# EAGLE design sensor (EAGLE 9.6.2)
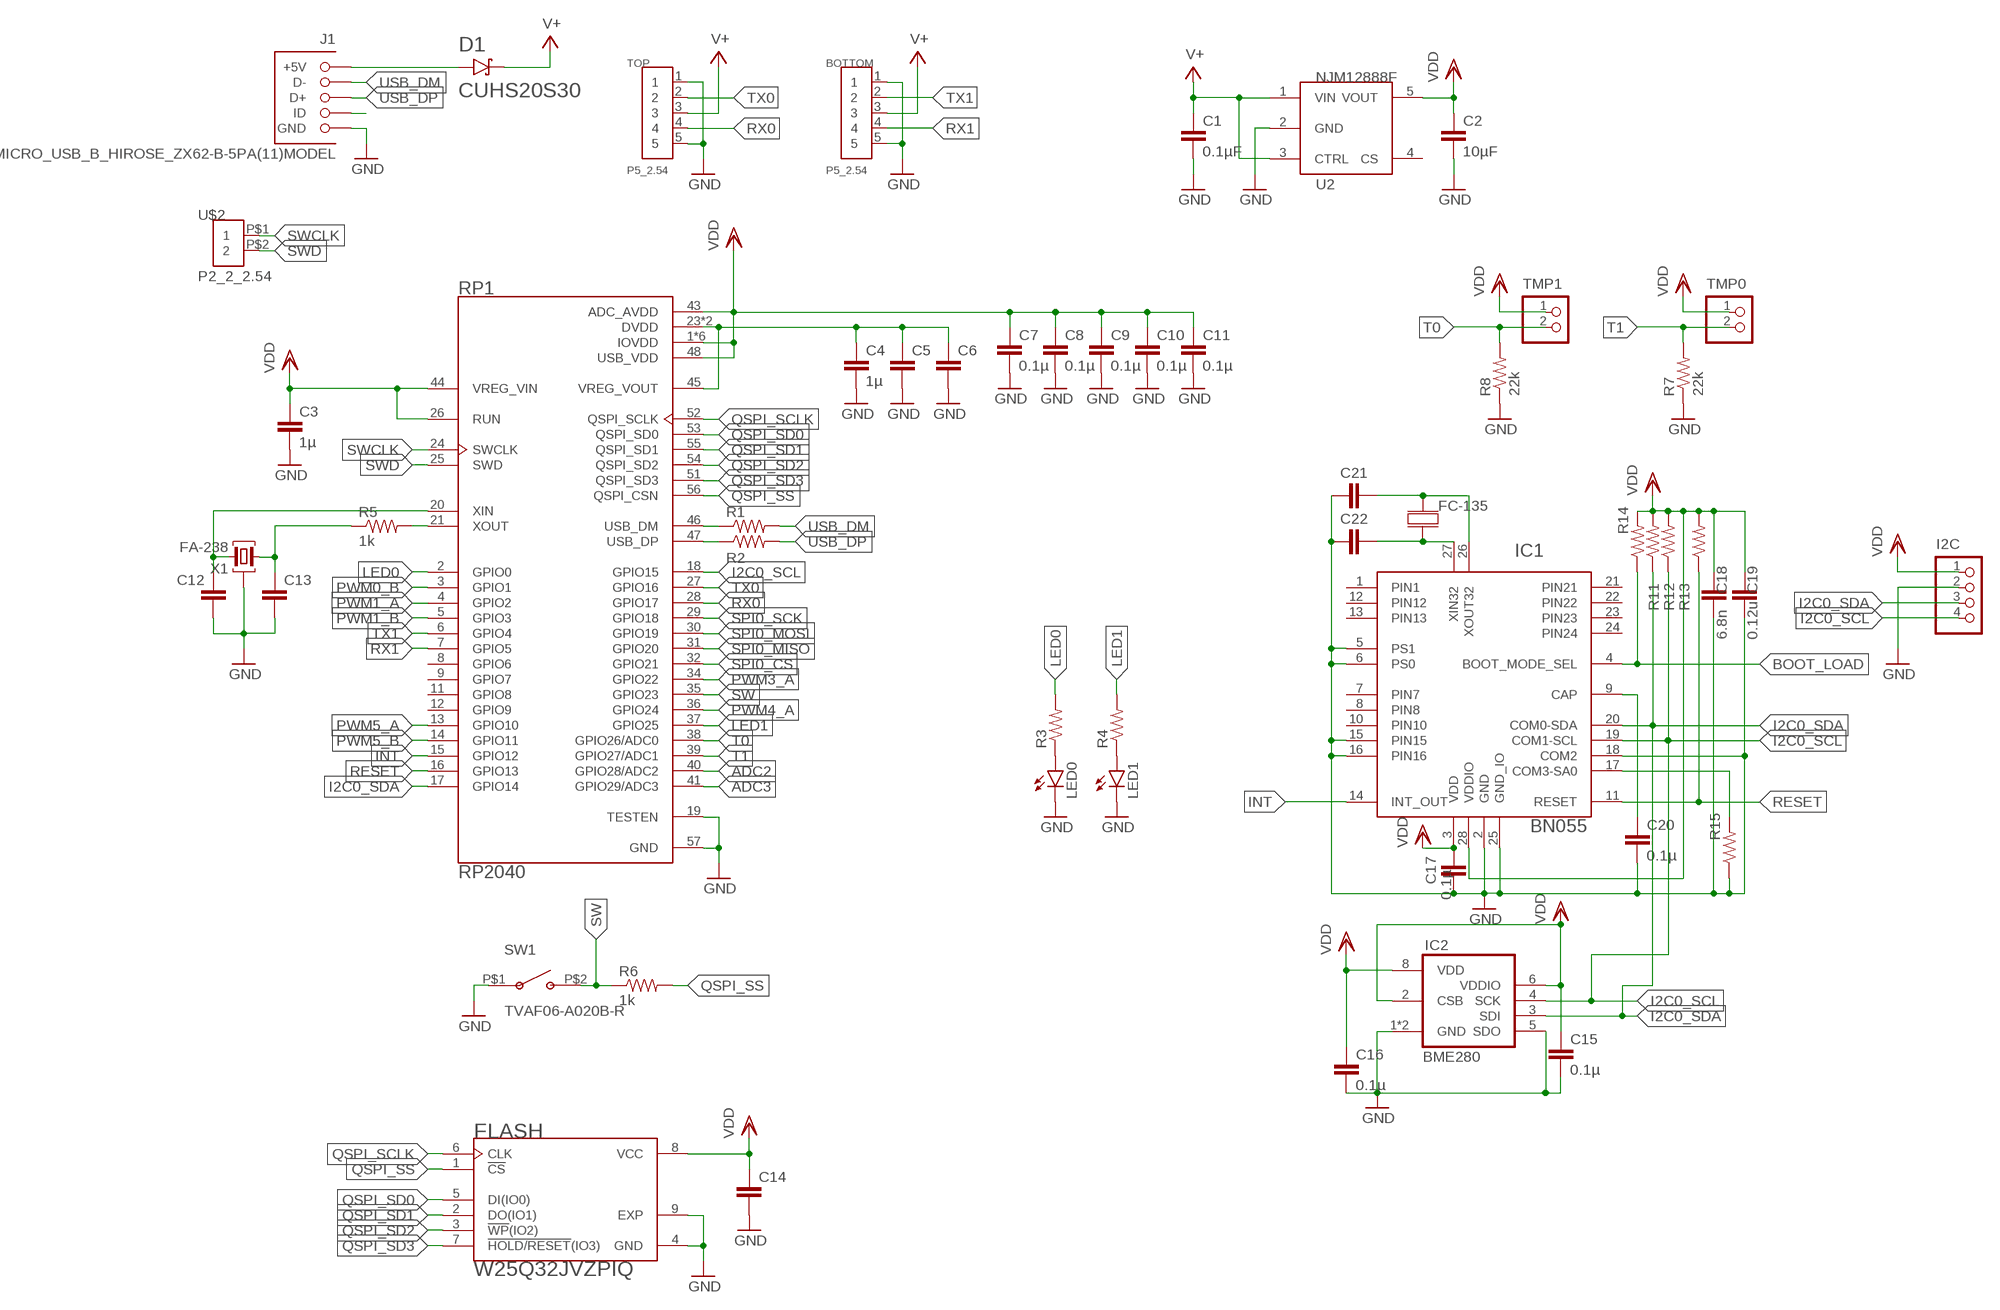
[diagram p0: schematic, sheet 1]

## Parts
BOTTOM  P5_2.54  [P5_2.54]
C1  0.1µF  C-EUC0402  [C0402]
C2  10µF  C-EUC0402  [C0402]
C3  1µ  C-EUC0402  [C0402]
C4  1µ  C-EUC0402  [C0402]
C5  C-EUC0402  [C0402]
C6  C-EUC0402  [C0402]
C7  0.1µ  C-EUC0402  [C0402]
C8  0.1µ  C-EUC0402  [C0402]
C9  0.1µ  C-EUC0402  [C0402]
C10  0.1µ  C-EUC0402  [C0402]
C11  0.1µ  C-EUC0402  [C0402]
C12  C-EUC0402  [C0402]
C13  C-EUC0402  [C0402]
C14  C-EUC0402  [C0402]
C15  0.1µ  C-EUC0402  [C0402]
C16  0.1µ  C-EUC0402  [C0402]
C17  0.1µ  C-EUC0402  [C0402]
C18  6.8n  C-EUC0402  [C0402]
C19  0.12u  C-EUC0402  [C0402]
C20  0.1µ  C-EUC0402  [C0402]
C21  C-EUC0402  [C0402]
C22  C-EUC0402  [C0402]
D1  CUHS20S30  [CUHS20S30]
FC-135  FC-135  [FC-135]
FLASH  W25Q32JVZPIQ  [SON127P600X500X80-9N]
I2C  B4B-PH-K-S  [B4B-PH-K-S]
IC1  BN055  1658_BNO055  [LGA-28_3.80X5.20/0.5]
IC2  BME280  [BME280]
J1  MICRO_USB_B_HIROSE_ZX62-B-5PA(11)MODEL  [GHI-CONNECTORS_10118192-0001LF(MICRO-USB-B-AMPHENOL-FCI)]
LED0  LEDCHIPLED_0603  [CHIPLED_0603]
LED1  LEDCHIPLED_0603  [CHIPLED_0603]
R1  R-US_R0402  [R0402]
R2  R-US_R0402  [R0402]
R3  R-US_R0402  [R0402]
R4  R-US_R0402  [R0402]
R5  1k  R-US_R0402  [R0402]
R6  1k  R-US_R0402  [R0402]
R7  22k  R-US_R0402  [R0402]
R8  22k  R-US_R0402  [R0402]
R11  R-US_R0402  [R0402]
R12  R-US_R0402  [R0402]
R13  R-US_R0402  [R0402]
R14  R-US_R0402  [R0402]
R15  R-US_R0402  [R0402]
RP1  RP2040  [QFN40P700X700X90-57N]
SW1  TVAF06-A020B-R  [TVAF06-A020B-R]
TMP0  S2B-PH-K-S  [S2B-PH-K-S]
TMP1  S2B-PH-K-S  [S2B-PH-K-S]
TOP  P5_2.54  [P5_2.54]
U2  NJM12888F  [SOT95P240X110-5N]
U$2  P2_2_2.54  [P2_2.54]
X1  FA-238  [FA-238]

## Nets
1V2: C4.1 C5.1 C6.1 RP1.23(DVDD) RP1.45(VREG_VOUT) RP1.50(DVDD)
ADC2: RP1.40(GPIO28/ADC2)
ADC3: RP1.41(GPIO29/ADC3)
BOOT_LOAD: IC1.4(BOOT_MODE_SEL) R14.1
GND: BOTTOM.1 BOTTOM.5 C1.2 C2.2 C3.2 C4.2 C5.2 C6.2 C7.2 C8.2 C9.2 C10.2 C11.2 C12.2 C13.2 C14.2 C15.2 C16.2 C17.2 C18.2 C19.2 C20.2 C21.1 C22.1 FLASH.4(GND) FLASH.9(EXP) I2C.2 IC1.2(GND) IC1.5(PS1) IC1.6(PS0) IC1.15(PIN15) IC1.16(PIN16) IC1.18(COM2) IC1.25(GND_IO) IC2.1(GND) IC2.5(SDO) IC2.7(GND) J1.CGND1(GND) J1.CGND2(GND) J1.CGND3(GND) J1.CGND4(GND) J1.CGND5(GND) J1.CGND6(GND) J1.GND LED0.C LED1.C R7.1 R8.1 R15.1 RP1.19(TESTEN) RP1.57(GND) SW1.P$1(A) TOP.1 TOP.5 U2.2(GND) X1.2(G) X1.4(G)
I2C0_SCL: I2C.4 IC1.19(COM1-SCL) IC2.4(SCK) R12.1 RP1.18(GPIO15)
I2C0_SDA: I2C.3 IC1.20(COM0-SDA) IC2.3(SDI) R11.1 RP1.17(GPIO14)
INT: IC1.14(INT_OUT) RP1.15(GPIO12)
LED0: R3.2 RP1.2(GPIO0)
LED1: R4.2 RP1.37(GPIO25)
N$1: C20.1 IC1.9(CAP)
N$3: C22.2 FC-135.P$2 IC1.27(XIN32)
N$4: C21.2 FC-135.P$1 IC1.26(XOUT32)
N$5: J1.ID
N$6: D1.A J1.VBUS(+5V)
N$8: LED0.A R3.1
N$9: LED1.A R4.1
N$10: IC1.17(COM3-SA0) R15.2
N$11: C13.1 R5.1 X1.1
PWM0_B: RP1.3(GPIO1)
PWM1_A: RP1.4(GPIO2)
PWM1_B: RP1.5(GPIO3)
PWM3_A: RP1.34(GPIO22)
PWM4_A: RP1.36(GPIO24)
PWM5_A: RP1.13(GPIO10)
PWM5_B: RP1.14(GPIO11)
QSPI_SCLK: FLASH.6(CLK) RP1.52(QSPI_SCLK)
QSPI_SD0: FLASH.5(DI(IO0)) RP1.53(QSPI_SD0)
QSPI_SD1: FLASH.2(DO(IO1)) RP1.55(QSPI_SD1)
QSPI_SD2: FLASH.3(!WP!(IO2)) RP1.54(QSPI_SD2)
QSPI_SD3: FLASH.7(!HOLD/RESET!(IO3)) RP1.51(QSPI_SD3)
QSPI_SS: FLASH.1(!CS) R6.2 RP1.56(QSPI_CSN)
RESET: IC1.11(RESET) R13.1 RP1.16(GPIO13)
RX0: RP1.28(GPIO17) TOP.4
RX1: BOTTOM.4 RP1.7(GPIO5)
SPI0_CS: RP1.32(GPIO21)
SPI0_MISO: RP1.31(GPIO20)
SPI0_MOSI: RP1.30(GPIO19)
SPI0_SCK: RP1.29(GPIO18)
SW: R6.1 RP1.35(GPIO23) SW1.P$2(B)
SWCLK: RP1.24(SWCLK) U$2.P$1
SWD: RP1.25(SWD) U$2.P$2
T0: R8.2 RP1.38(GPIO26/ADC0) TMP1.2
T1: R7.2 RP1.39(GPIO27/ADC1) TMP0.2
TX0: RP1.27(GPIO16) TOP.2
TX1: BOTTOM.2 RP1.6(GPIO4)
USB_DM: J1.D- R1.2
USB_DM_1: R1.1 RP1.46(USB_DM)
USB_DP: J1.D+ R2.2
USB_DP_1: R2.1 RP1.47(USB_DP)
V+: BOTTOM.3 C1.1 D1.C TOP.3 U2.1(VIN) U2.3(CTRL)
VDD: C2.1 C3.1 C7.1 C8.1 C9.1 C10.1 C11.1 C14.1 C15.1 C16.1 C17.1 C18.1 C19.1 FLASH.8(VCC) I2C.1 IC1.3(VDD) IC1.28(VDDIO) IC2.2(CSB) IC2.6(VDDIO) IC2.8(VDD) R11.2 R12.2 R13.2 R14.2 RP1.1(IOVDD) RP1.10(IOVDD) RP1.22(IOVDD) RP1.26(RUN) RP1.33(IOVDD) RP1.42(IOVDD) RP1.43(ADC_AVDD) RP1.44(VREG_VIN) RP1.48(USB_VDD) RP1.49(IOVDD) TMP0.1 TMP1.1 U2.5(VOUT)
XIN1: C12.1 RP1.20(XIN) X1.3
XOUT1: R5.2 RP1.21(XOUT)
Unconnected: IC1.1(PIN1) IC1.7(PIN7) IC1.8(PIN8) IC1.10(PIN10) IC1.12(PIN12) IC1.13(PIN13) IC1.21(PIN21) IC1.22(PIN22) IC1.23(PIN23) IC1.24(PIN24) RP1.8(GPIO6) RP1.9(GPIO7) RP1.11(GPIO8) RP1.12(GPIO9) U2.4(CS)

## Library data of the parts
BOTTOM TOP = pins:P5_2.54
C1-C22 = rcl:C-EU: CAPACITOR, European symbol; SPICEPREFIX: C
D1 = diodes:CUHS20S30
FC-135 = tere:FC-135
FLASH = W25Q32JVZPIQ:W25Q32JVZPIQ: Serial Flash Memory With Dual, Quad Spi Check availability <https://pricing.snapeda.com/parts/W25Q32JVZPIQ/Winbond/view-part?ref=eda>; AVAILABILITY: In Stock; DESCRIPTION: FLASH - NOR Memory IC 32Mb (4M x 8) SPI - Quad I/O 133 MHz 8-WSON (6x5); MF: Winbond; MP: W25Q32JVZPIQ; PACKAGE: WSON-8 Winbond; PRICE: None; PURCHASE-URL: https://pricing.snapeda.com/search/part/W25Q32JVZPIQ/?ref=eda
I2C = jst-ph:B4B-PH-*: Wire-to-Board 2.0mm pitch top mount connector Source: http://www.jst-mfg.com/product/pdf/jpn/PH.pdf http://www.jst-mfg.com/product/detail.php?series=199
IC1 = BNO055:1658_BNO055: BN055 Intelligent 9-axis absolute orientation sensor; PART_NUMBER: BNO055
IC2 = bosch-bme280:BME280: DIGITAL HUMIDITY, PRESSURE AND TEMPERATURE SENSOR * Digital interface I²C (up to 3.4 MHz) and SPI (3 and 4 wire, up to 10 MHz)* Supply voltage VDD main supply voltage range: 1.71 V to 3.6 V*VDDIO interface voltage range: 1.2 V to 3.6 V Operating range -40…+85 °C, 0…100 % rel. humidity, 300…1100 hPa The library has been designed by Richard Magdycz <https://www.facebook.com/groups/eaglecadsoftUK>
J1 = connector:MICRO_USB_B_HIROSE_ZX62-B-5PA(11): Connector Receptacle USB - micro B 2.0 5 Position Surface Mount, Right Angle, Horizontal Bottom Mount
LED0 LED1 = led:LED: LED OSRAM: - CHIPLED LG R971, LG N971, LY N971, LG Q971, LY Q971, LO R971, LY R971 LH N974, LH R974 LS Q976, LO Q976, LY Q976 LO Q996 - Hyper CHIPLED LW Q18S LB Q993, LB Q99A, LB R99A - SideLED LS A670, LO A670, LY A670, LG A670, LP A670 LB A673, LV A673, LT A673, LW A673 LH A674 LY A675 LS A676, LA A676, LO A676, LY A676, LW A676 LS A679, LY A679, LG A679 - Hyper Micro SIDELED® LS Y876, LA Y876, LO Y876, LY Y876 LT Y87S - SmartLED LW L88C, LW L88S LB L89C, LB L89S, LG L890 LS L89K, LO L89K, LY L89K LS L896, LA L896, LO L896, LY L896 - TOPLED LS T670, LO T670, LY T670, LG T670, LP T670 LSG T670, LSP T670, LSY T670, LOP T670, LYG T670 LG T671, LOG T671, LSG T671 LB T673, LV T673, LT T673, LW T673 LH T674 LS T676, LA T676, LO T676, LY T676, LB T676, LH T676, LSB T676, LW T676 LB T67C, LV T67C, LT T67C, LS T67K, LO T67K, LY T67K, LW E67C LS E67B, LA E67B, LO E67B, LY E67B, LB E67C, LV E67C, LT E67C LW T67C LS T679, LY T679, LG T679 LS T770, LO T770, LY T770, LG T770, LP T770 LB T773, LV T773, LT T773, LW T773 LH T774 LS E675, LA E675, LY E675, LS T675 LS T776, LA T776, LO T776, LY T776, LB T776 LHGB T686 LT T68C, LB T68C - Hyper Mini TOPLED® LB M676 - Mini TOPLED Santana® LG M470 LS M47K, LO M47K, LY M47K Source: http://www.osram.convergy.de LUXEON: - LUMILED® LXK2-PW12-R00, LXK2-PW12-S00, LXK2-PW14-U00, LXK2-PW14-V00 LXK2-PM12-R00, LXK2-PM12-S00, LXK2-PM14-U00 LXK2-PE12-Q00, LXK2-PE12-R00, LXK2-PE12-S00, LXK2-PE14-T00, LXK2-PE14-U00 LXK2-PB12-K00, LXK2-PB12-L00, LXK2-PB12-M00, LXK2-PB14-N00, LXK2-PB14-P00, LXK2-PB14-Q00 LXK2-PR12-L00, LXK2-PR12-M00, LXK2-PR14-Q00, LXK2-PR14-R00 LXK2-PD12-Q00, LXK2-PD12-R00, LXK2-PD12-S00 LXK2-PH12-R00, LXK2-PH12-S00 LXK2-PL12-P00, LXK2-PL12-Q00, LXK2-PL12-R00 Source: www.luxeon.com KINGBRIGHT: KA-3528ASYC Source: www.kingbright.com
R1-R8 R11-R15 = rcl:R-US_: RESISTOR, American symbol; SPICEPREFIX: R
RP1 = RP2040:RP2040: Check availability <https://pricing.snapeda.com/parts/RP2040/Raspberry%20Pi/view-part?ref=eda>; AVAILABILITY: In Stock; DESCRIPTION: RP2040 chip for Raspberry Pi Pico - ARM® Cortex®-M0+ MCU 32-Bit; MF: Raspberry Pi; MP: RP2040; PACKAGE: None; PRICE: None; PURCHASE-URL: https://pricing.snapeda.com/search/part/RP2040/?ref=eda
SW1 = switches:TVAF06-A020B-R
TMP0 TMP1 = jst-ph:S2B-PH-*: Wire-to-Board 2.0mm pitch side mount connector Source: http://www.jst-mfg.com/product/pdf/jpn/PH.pdf http://www.jst-mfg.com/product/detail.php?series=199
U2 = regulators:NJM12888F
U$2 = pins:P2_2_2.54
X1 = crystal':FA-238: CRYSTAL

## Board
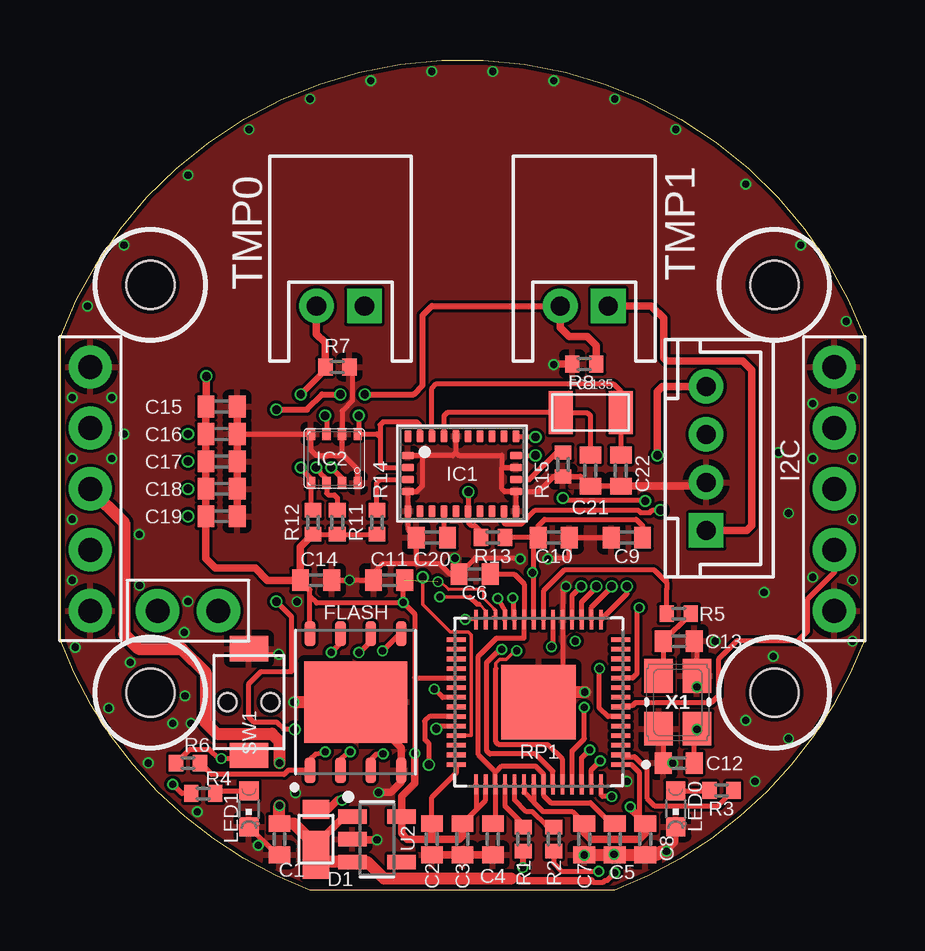
[diagram p1: board, top side]
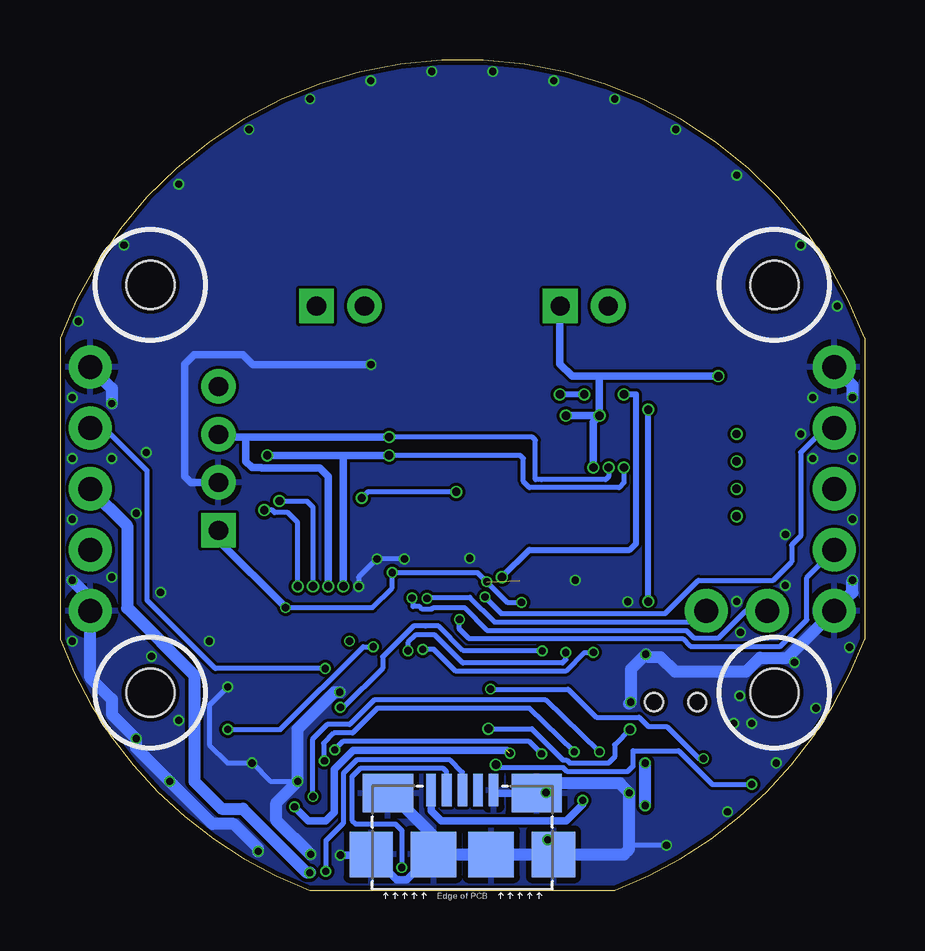
[diagram p2: board, bottom side, seen from below]

Size 33.53 x 34.61 mm. Coordinates in mm from the lower left corner, seen from the top.
Outline: 33.53,23.01 33.53,10.46 arc-49 23.11,0 10.41,0 arc-49 0,10.46 0,23.01 arc-139 33.53,23.01
Copper layers (1*16): Top 0.035mm / dielectric 1mm / Bottom 0.035mm
Design rules "jlcpcb-2layers-1.0mm": minimum track width 5mil, minimum drill 0.3mm, track to track 5mil, track to pad 5mil, pad to pad 5mil, via to via 5mil, smd to smd 5mil, copper to edge 0.2mm, drill to drill 6mil, minimum pad ring 10mil, minimum via ring 3mil, stop-mask expansion 4mil, vias tented up to drill 1mm, thermal gap 10mil
Holes 2 mm at 29.76,25.24 29.76,8.24 3.76,25.24 3.76,8.24

### Footprints (pad centres in the part's own frame; a part is rotated, then mirrored left to right if it is on the bottom)
P5_2.54 = drill 1: 1 0,5.08; 2 0,2.54; 3 0,0; 4 0,-2.54; 5 0,-5.08
C0402 = smd 0.7 x 0.9: 1 -0.65,0; 2 0.65,0
CUHS20S30 = smd 0.8 x 1.1: A 1.25,0 | smd 2 x 1.1: C -0.65,0
FC-135 = smd 1 x 1.8: P$1 0,0; P$2 2.5,0
SON127P600X500X80-9N = smd 1.04 x 0.44: 1 -2.845,1.905; 2 -2.845,0.635; 3 -2.845,-0.635; 4 -2.845,-1.905; 5 2.845,-1.905; 6 2.845,-0.635; 7 2.845,0.635; 8 2.845,1.905 | smd 3.4 x 4.3: 9 0,0
B4B-PH-K-S = drill 0.8 square: 1 -3,0 | drill 0.8: 2 -1,0; 3 1,0; 4 3,0
LGA-28_3.80X5.20/0.5 = smd 0.3 x 0.5: 1 -2.25,1.56; 6 -2.25,-1.56; 7 -1.75,-1.56; 8 -1.25,-1.56; 9 -0.75,-1.56; 10 -0.25,-1.56; 11 0.25,-1.56; 12 0.75,-1.56; 13 1.25,-1.56; 14 1.75,-1.56; 15 2.25,-1.56; 20 2.25,1.56; 21 1.75,1.56; 22 1.25,1.56; 23 0.75,1.56; 24 0.25,1.56; 25 -0.25,1.56; 26 -0.75,1.56; 27 -1.25,1.56; 28 -1.75,1.56 | smd 0.5 x 0.3: 2 -2.25,0.75; 3 -2.25,0.25; 4 -2.25,-0.25; 5 -2.25,-0.75; 16 2.25,-0.75; 17 2.25,-0.25; 18 2.25,0.25; 19 2.25,0.75
BME280 = smd 0.35 x 0.5: 1 0.975,-1.025; 2 0.325,-1.025; 3 -0.325,-1.025; 4 -0.975,-1.025; 5 -0.975,1.025; 6 -0.325,1.025; 7 0.325,1.025; 8 0.975,1.025
GHI-CONNECTORS_10118192-0001LF(MICRO-USB-B-AMPHENOL-FCI) = smd 1.8 x 1.9: CGND1 -3.8,0; CGND4 3.8,0 | smd 1.9 x 1.9: CGND2 -1.2,0; CGND3 1.2,0 | smd 2.1 x 1.6: CGND5 3.1,2.55; CGND6 -3.1,2.55 | smd 0.4 x 1.35: D+ 0,2.675; D- -0.65,2.675; GND 1.3,2.675; ID 0.65,2.675; VBUS -1.3,2.675
CHIPLED_0603 = smd 0.8 x 0.8: A 0,-0.75; C 0,0.75
R0402 = smd 0.6 x 0.7: 1 -0.5,0; 2 0.5,0
QFN40P700X700X90-57N = smd 0.84 x 0.2: 1 -3.435,2.6; 2 -3.435,2.2; 3 -3.435,1.8; 4 -3.435,1.4; 5 -3.435,1; 6 -3.435,0.6; 7 -3.435,0.2; 8 -3.435,-0.2; 9 -3.435,-0.6; 10 -3.435,-1; 11 -3.435,-1.4; 12 -3.435,-1.8; 13 -3.435,-2.2; 14 -3.435,-2.6; 29 3.435,-2.6; 30 3.435,-2.2; 31 3.435,-1.8; 32 3.435,-1.4; 33 3.435,-1; 34 3.435,-0.6; 35 3.435,-0.2; 36 3.435,0.2; 37 3.435,0.6; 38 3.435,1; 39 3.435,1.4; 40 3.435,1.8; 41 3.435,2.2; 42 3.435,2.6 | smd 0.2 x 0.84: 15 -2.6,-3.435; 16 -2.2,-3.435; 17 -1.8,-3.435; 18 -1.4,-3.435; 19 -1,-3.435; 20 -0.6,-3.435; 21 -0.2,-3.435; 22 0.2,-3.435; 23 0.6,-3.435; 24 1,-3.435; 25 1.4,-3.435; 26 1.8,-3.435; 27 2.2,-3.435; 28 2.6,-3.435; 43 2.6,3.435; 44 2.2,3.435; 45 1.8,3.435; 46 1.4,3.435; 47 1,3.435; 48 0.6,3.435; 49 0.2,3.435; 50 -0.2,3.435; 51 -0.6,3.435; 52 -1,3.435; 53 -1.4,3.435; 54 -1.8,3.435; 55 -2.2,3.435; 56 -2.6,3.435 | smd 3.1 x 3.1: 57 0,0
TVAF06-A020B-R = smd 1.6 x 1.05: P$1 0,2.225; P$2 0,-2.225 | hole 0.75: -0.9,0; 0.9,0
S2B-PH-K-S = drill 0.8 square: 1 1,0 | drill 0.8: 2 -1,0
SOT95P240X110-5N = smd 1.18 x 0.609: 1 -1.024,0.95; 2 -1.024,0; 3 -1.024,-0.95; 4 1.024,-0.95; 5 1.024,0.95
P2_2.54 = drill 1: P$1 0,1.27; P$2 0,-1.27
FA-238 = smd 1.4 x 1.2: 1 -1.1,-0.8; 2 1.1,-0.8; 3 1.1,0.8; 4 -1.1,0.8

### Placement (x,y rotation side)
BOTTOM  32.26,16.74 0 top
C1  9.14,2.13 270 top
C2  15.49,2.13 270 top
C3  16.76,2.13 270 top
C4  18.03,2.13 270 top
C5  23.11,2.13 270 top
C6  17.27,13.18 180 top
C7  21.84,2.13 270 top
C8  24.38,2.13 270 top
C9  23.62,14.7 180 top
C10  20.57,14.7 0 top
C11  13.72,12.93 180 top
C12  25.78,5.31 180 top
C13  25.78,10.39 0 top
C14  10.67,12.93 0 top
C15  6.73,20.16 0 top
C16  6.73,19.02 0 top
C17  6.73,17.88 0 top
C18  6.73,16.74 0 top
C19  6.73,15.59 0 top
C20  15.49,14.7 180 top
C21  22.1,17.5 90 top
C22  23.37,17.5 90 top
D1  10.67,2.13 90 top
FC-135  20.86,19.92 0 top
FLASH  12.32,7.85 90 top
I2C  26.92,18.01 90 top
IC1  16.75,17.37 0 top
IC2  11.43,18.01 0 top
J1  16.76,1.5 0 bottom
LED0  25.65,3.4 180 top
LED1  7.87,3.4 180 top
R1  19.3,2.13 270 top
R2  20.57,2.13 270 top
R3  27.56,4.16 0 top
R4  5.97,4.04 180 top
R5  25.78,11.53 180 top
R6  5.33,5.31 0 top
R7  11.56,21.82 180 top
R8  21.84,21.94 0 top
R11  11.56,15.34 270 top
R12  10.54,15.34 270 top
R13  18.03,14.7 0 top
R14  13.21,15.34 270 top
R15  20.95,17.75 90 top
RP1  19.94,7.85 180 top
SW1  7.87,7.85 0 top
TMP0  11.68,24.36 0 top
TMP1  21.84,24.36 0 top
TOP  1.26,16.74 0 top
U2  13.21,2.13 0 top
U$2  5.33,11.66 90 top
X1  25.74,7.84 270 top

### Tracks (layer width: path | path; a pad name or v marks a point on that pad's centre or on a via)
1V2
  Top 0.2: C4.1 18.14,2.89 RP1.45 18.14,4.9 18.16,4.92 | C5.1 22.97,2.78 22.1,3.65 20.45,3.65 20.14,3.96 RP1.50 20.14,4.85 19.81,5.18 18.41,5.18 18.16,4.92 | 18.16,4.92 17.43,5.65 17.43,9.75 18.2,10.52 19.34,10.52 RP1.23 19.34,12.76 18.92,13.18 C6.1
BOOT_LOAD
  Top 0.2: R14.1 13.21,16.99 13.34,17.12 IC1.4
GND  (via drill 0.3)
  Top 0.2: 21.19,14.67 C10.2 | C10.2 21.22,13.86 20.36,13.86 v20.32,13.81 | C14.2 v12.06,12.93 C11.2 13.07,13.25 13.41,13.6 14.86,13.6 | 14.86,13.6 15.83,13.6 16.25,13.18 C6.2 17.3,13.86 19.13,13.86 v19.18,13.81 | C10.2 C9.2 | RP1.57 20.94,8.85 RP1.19 20.94,12.53 v21.08,12.67 | SW1.P$1 8.1,9.84 v9.12,9.84 | LED1.C 8.45,2.07 | 8.45,2.07 9.04,1.48 C1.2 | LED0.C 25.65,2 v25.27,1.62 | X1.2 25.13,6.55 C12.2 v25.53,5.31 | C13.2 26.54,10.28 X1.4 v26.54,8.48 | C16.2 IC2.5 10.45,18.35 10.67,18.13 11.7,18.13 11.75,18.19 | R7.1 12.18,21.69 12.18,20.41 11.75,19.98 IC2.7 11.75,18.19 | IC2.1 12.4,17.54 11.75,18.19 | IC1.25 16.5,18.25 | 15.11,18.12 16.37,18.12 16.5,18.25 | 15.11,18.12 IC1.2 | 18.41,17.62 IC1.18 | IC1.16 IC1.15 | C22.1 C21.1 21.69,17.25 R15.1 20.57,17.25 19.94,16.62 IC1.16 | 14.86,13.6 14.84,13.62 C20.2 14.5,15.05 IC1.6 IC1.5 14.86,16.62 15.11,16.87 15.11,18.12 | IC1.16 18.53,16.62 18.41,16.74 18.41,17.62 | 16.5,18.25 16.61,18.13 18.41,18.13 18.41,17.62 | v8.25,1.88 8.45,2.07
  Top 0.305: FLASH.9 14.22,5.94 FLASH.4 14.22,4.51 13.79,4.07 v13.27,4.07 | v13.21,2.1 12.21,2.1 U2.2 | C7.2 v21.84,1.46 | C4.2 C3.2 C2.2 | C15.2 C16.2 C17.2 C18.2 C19.2 | C22.1 26.77,16.85 I2C.2 | v20.57,21.92 20.59,21.94 R8.1
  Top 0.508: v9.74,7.85 FLASH.9 | C7.2 C5.2 C8.2 24.89,1.48 25.04,1.62 v25.27,1.62 | RP1.57 20.35,8.26 v21.87,8.26
  Bottom 0.2: J1.CGND2 17.65,1.5 | v23.62,4.54 24.77,4.54 v25.53,5.31 26.54,5.31 27.3,6.07 27.3,7.72 v26.54,8.48 | v19.18,13.81 v20.32,13.81 21.08,13.05 v21.08,12.67 | v8.25,1.88 9.68,1.88 9.81,2
  Bottom 0.305: J1.CGND4 13.21,1.74 v13.21,2.1 | J1.GND 15.34,4.05 J1.CGND5 | v21.84,1.46 20.59,1.46 J1.CGND1 20.55,1.5 19.5,0.44 19.08,0.44 18.02,1.5 | v20.57,21.92 25.51,21.92 25.91,22.32 27.94,22.32 28.32,21.94 28.32,17.24 28.08,17.01 I2C.2
  Bottom 0.508: J1.CGND6 19.75,4.05 17.96,2.26 J1.CGND2 18.02,1.5 | 17.65,1.5 J1.CGND3 J1.CGND4 10.03,1.5 9.81,1.72 9.81,2 v9.81,4.07 10.2,4.46 13.25,4.46 J1.CGND5 | 9.81,7.78 v9.74,7.85 9.74,9.21 v9.12,9.84 | v25.27,1.62 25.27,1.74 26.3,2.77 27.18,2.77 v28.96,4.54 30.35,5.94 v30.35,6.32 31.37,7.34 31.37,7.97 32.26,8.86 BOTTOM.5 32.26,12.17 v33.02,12.93 | v23.08,1.49 v23.09,1.5 23.11,1.5 24.51,2.9 24.51,3.65 v23.62,4.54 23.62,6.73 22.09,8.26 v21.87,8.26 | v9.12,9.84 9.12,9.81 9.09,9.78 | BOTTOM.1 31.37,20.92 v31.37,20.29 | TOP.1 0.51,21.06 v0.51,20.55 | v0.51,12.93 0.51,12.41 TOP.5 3.23,9.69 4.37,9.69 4.94,9.12 7.9,9.12 8.51,9.72 9,9.72 v9.12,9.84
  other vias: 33.02,10.39 33.02,20.55 5.33,29.82 32.77,23.72 30.86,26.9 28.57,29.44 25.65,31.72 23.11,32.99 20.57,33.75 18.03,34.13 15.49,34.13 12.95,33.75 10.41,32.99 7.87,31.72 2.67,26.9 1.14,24.36 0.51,18.01 0.51,15.47 0.63,10.13 2.03,7.59 3.68,5.31 4.7,6.96 29.72,9.75 33.02,15.47 33.02,18.01 31.37,18.01 30.35,15.72 31.37,13.05 29.34,12.42 27.3,10.39 28.57,7.08 5.71,3.27 5.46,6.96 2.67,19.02 3.3,14.83 2.92,9.5 3.31,12.71 5.21,8.1 9.87,12.03 2.16,20.55 2.16,18.01 16.45,13.85 29.93,18.25 5.33,12.04 5.17,10.75
  pour Top: -6.1,37.06 38.35,37.06 38.35,-3.58 -6.1,-3.58
  pour Bottom: -7.24,44.68 42.16,44.68 42.16,-6.89 -7.24,-6.89
  pour Bottom: -1.78,0.35 1.52,-2.95 35.56,-2.95 37.59,-0.92 37.59,35.91 35.05,38.45 -1.65,38.45 -1.27,38.07
I2C0_SCL  (via drill 0.35)
  Top 0.2: R12.1 10.45,15.92 IC2.4 10.45,17.16 10.19,17.43 10.19,17.47 v10.03,17.62 | IC1.19 19.01,18.13 v19.81,18.13 | RP1.18 21.34,12.29 21.54,12.48 21.54,12.49 v21.72,12.67
  Top 0.305: I2C.4 25.1,21.01 24.89,20.8 v24.89,18.13
  Bottom 0.2: v10.03,17.62 10.03,16.99 10.23,16.79 13.97,16.79 14.22,17.04 14.22,18.01 14.35,18.13 v19.81,18.13
  Bottom 0.305: v24.89,18.13 21.72,18.13 | 21.72,18.13 v19.81,18.13 | v21.72,12.67 21.72,18.13
I2C0_SDA  (via drill 0.35)
  Top 0.2: R11.1 11.56,16.35 11.43,16.48 11.18,16.48 11.11,16.55 IC2.3 11.11,17.15 10.82,17.43 10.82,17.47 v10.67,17.62 | v19.81,18.89 19.03,18.89 IC1.20 | v22.35,12.67 22.2,12.51 22.2,12.47 21.74,12.02 RP1.17
  Bottom 0.2: v10.67,17.62 10.67,17.24 10.79,17.12 13.46,17.12 13.72,17.12 13.72,18.77 13.84,18.89 v19.81,18.89
  Bottom 0.305: v19.81,18.89 25.78,18.89 | 25.78,18.89 26.81,18.89 I2C.3 | v22.35,12.67 22.35,17.24 22.71,17.6 25.11,17.6 25.13,17.62 25.53,17.62 25.78,17.88 25.78,18.89
INT  (via drill 0.35)
  Top 0.2: RP1.15 23.62,12.36 v23.62,12.67 | IC1.14 18.5,15.32 18.54,15.28 19.25,15.28 19.81,15.85 24.09,15.85 24.19,15.75 24.58,15.75 24.68,15.85 v25.02,15.85
  Bottom 0.2: v23.62,12.67 23.62,15.34 24.03,15.75 24.58,15.75 24.68,15.85 v25.02,15.85
LED0
  Top 0.2: RP1.2 23.45,5.57 23.94,5.57 24.46,5.06 24.46,3.84 24.77,3.52 27.42,3.52 R3.2
LED1  (via drill 0.3, 0.35)
  Top 0.2: R4.2 5.08,4.04 v4.7,4.42 | RP1.37 15.4,7.25 15.2,7.05 15.2,6.28 15.37,6.12 v15.37,5.24
  Bottom 0.2: v4.7,4.42 6.35,4.42 7.75,5.81 9.65,5.81 9.65,5.18 9.89,4.94 12.39,4.94 12.55,5.11 15.24,5.11 v15.37,5.24
N$1
  Top 0.2: IC1.9 16,14.85 C20.1
N$2  (via drill 0.35)
  other vias: 5.33,19.02
N$3
  Top 0.2: C22.2 23.36,18.16 FC-135.P$2 23.36,20.81 23.05,21.12 15.68,21.12 15.49,20.93 15.5,20.92 IC1.27
N$4
  Top 0.2: C21.2 22.1,19.78 21.96,19.92 FC-135.P$1 16.13,19.92 16,19.78 IC1.26
N$6  (via drill 0.3)
  Top 0.305: D1.A 11.19,3.38 11.58,3.77 11.73,3.77 v11.75,3.75
  Bottom 0.305: J1.VBUS 18.06,3.3 17.65,2.89 12.44,2.89 11.75,3.58 v11.75,3.75
N$7  (via drill 0.35)
  other vias: 5.33,17.88
N$8
  Top 0.2: LED0.A 27.05,4.15 R3.1
N$9
  Top 0.2: R4.1 6.58,4.15 LED1.A
N$10
  Top 0.2: IC1.17 19.56,17.12 20.69,18.25 R15.2
N$11
  Top 0.2: R5.1 C13.1 25.13,9.13 X1.1
N$12  (via drill 0.3)
  other vias: 21.46,10.39
N$13  (via drill 0.35)
  other vias: 5.33,16.74
N$14  (via drill 0.35)
  other vias: 5.33,15.59
QSPI_SCLK  (via drill 0.3)
  Top 0.152: v19.03,9.99 18.95,9.99 18.59,9.62 18.32,9.62 18.16,9.45 18.16,9.24
  Top 0.2: RP1.52 20.94,5.45 20.32,6.07 18.29,6.07 18.16,6.19 18.16,9.24 | v12.45,9.91 12.5,9.91 12.95,10.37 FLASH.6
  Bottom 0.2: v12.45,9.91 12.45,9.61 12.59,9.48 16.75,9.48 17.91,10.64 18.71,10.64 19.03,10.32 v19.03,9.99
QSPI_SD0  (via drill 0.3)
  Top 0.2: RP1.53 21.34,5.82 21.84,6.32 v21.84,7.62 | FLASH.5 14.15,10.69 v13.44,9.98
  Bottom 0.2: v21.84,7.62 21.72,7.62 20.08,9.26 20.08,9.74 18.8,11.02 18.3,11.02 18.29,11.01 17.75,11.01 16.75,10.01 13.47,10.01 v13.44,9.98
QSPI_SD1  (via drill 0.3)
  Top 0.2: RP1.55 22.14,5.03 v22.51,5.4 | FLASH.2 11.68,5.43 11.94,5.69 v12.1,5.78
  Bottom 0.2: v22.51,5.4 22.54,5.43 22.54,6.13 22.11,6.56 21.34,6.56 20.31,7.59 13.97,7.59 v12.1,5.78
QSPI_SD2  (via drill 0.3)
  Top 0.2: RP1.54 21.74,5.52 v22.08,5.86 | FLASH.3 12.95,5.43 13.21,5.69 v13.46,5.69
  Bottom 0.2: v22.08,5.86 v22.08,5.87 21.72,6.22 14,6.22 v13.46,5.69
QSPI_SD3  (via drill 0.3)
  Top 0.2: RP1.51 20.54,4.96 19.81,5.69 17.91,5.69 17.77,5.82 17.77,9.5 18.2,9.92 18.28,9.92 v18.41,10.05 | v11.3,9.91 11.68,10.29 FLASH.7
  Bottom 0.2: v11.3,9.91 11.68,9.91 12.46,9.13 17.04,9.13 17.95,10.05 v18.41,10.05
QSPI_SS  (via drill 0.3)
  Top 0.2: RP1.56 22.54,3.98 22.61,3.91 v22.99,3.91 | R6.2 6.31,4.82 9.34,4.82 9.52,5 FLASH.1 10.41,5.43 10.67,5.69 v11.05,5.78
  Bottom 0.2: v22.99,3.91 22.99,6.32 22.4,6.91 21.46,6.91 20.44,7.93 13.29,7.93 v11.05,5.78
RESET  (via drill 0.35)
  Top 0.2: R13.1 17.53,14.95 17.27,15.21 17.14,15.21 17,15.36 IC1.11 17.02,15.83 v17.02,16.61 | v22.99,12.67 22.83,12.51 22.83,12.47 22.14,11.78 RP1.16 | v20.95,16.35 21.04,16.27 24.34,16.27 v24.38,16.23
  Bottom 0.2: v17.02,16.61 20.7,16.61 v20.95,16.35 | v24.38,16.23 23.24,16.23 22.99,15.97 v22.99,12.67
RX0  (via drill 0.3)
  Top 0.152: RP1.28 17.32,11.3 v16.88,11.3
  Bottom 0.2: v16.88,11.3 16.88,10.89 16.5,10.5 7.59,10.5 7.26,10.17 3.52,10.17 2.41,11.27 2.41,13.04 TOP.4
RX1
  Top 0.2: RP1.7 23.45,7.72 23.87,7.72 23.98,7.83 27.15,7.83 27.43,8.11 27.43,9.62 28.19,10.39 30.73,10.39 31.14,10.79 31.14,12.12 32.26,13.25 BOTTOM.4
SW  (via drill 0.3)
  Top 0.2: R6.1 5.41,5.88 6.23,5.88 6.62,5.49 v6.71,5.49 7.74,5.49 SW1.P$2 | RP1.35 15.94,8.04 v15.59,8.38
  Bottom 0.2: v15.59,8.38 12.36,8.38 11.18,7.21 9.4,7.21 9.21,7.02 9.02,6.83 8.89,6.83 | v6.71,5.49 6.92,5.49 8.25,6.83 8.89,6.83 | 8.89,6.83
SWCLK  (via drill 0.3)
  Top 0.2: v18.86,12.19 18.89,12.16 18.89,11.33 RP1.24
  Bottom 0.2: U$2.P$1 4.95,11.66 6.08,10.53 7.13,10.53 7.43,10.83 15.72,10.83 16.65,11.76 18,11.76 18.05,11.71 18.43,11.71 18.54,11.82 18.82,11.82 18.82,12.06 18.88,12.12 v18.86,12.19
SWD  (via drill 0.3)
  Top 0.2: RP1.25 18.54,11.66 v18.24,12.16
  Bottom 0.2: v18.24,12.16 18.26,12.16 18.31,12.22 16.45,12.22 15.41,11.19 7.07,11.19 U$2.P$2
T0  (via drill 0.35)
  Top 0.2: v15.68,6.73 15.79,6.85 RP1.38 | v9.78,6.7 9.34,6.7 9.03,7.01 8.08,7.01 7.87,7.21 7.87,8.61 8.38,9.12 9.65,9.12 9.65,11.4 v9.02,12.04
  Top 0.254: v9.02,20.04 10.29,20.04 10.92,20.67 v11.68,20.67 | v12.7,20.67 14.73,20.67 15.11,21.05 15.11,23.97 15.49,24.36 TMP1.2
  Top 0.305: TMP1.2 20.84,23.45 21.21,23.09 21.97,23.09 22.34,22.71 R8.2
  Bottom 0.2: v15.68,6.73 13.87,6.73 13.01,5.87 12.57,5.43 12.42,5.43 12.29,5.31 10.67,5.31 10.41,5.56 10.41,6.07 v9.78,6.7
  Bottom 0.254: v9.02,12.04 v9.02,20.04 | v11.68,20.67 v12.7,20.67
T1  (via drill 0.35)
  Top 0.152: RP1.39 17.13,6.45 17.13,10.64 17,10.77 16.26,10.77 15.11,11.91 v15.11,13.05
  Top 0.254: v10.03,20.67 11.06,21.7 R7.2
  Top 0.305: TMP0.2 10.68,23.2 11.06,22.82 R7.2
  Bottom 0.254: v15.11,13.05 13.97,14.2 9.78,14.2 9.52,14.45 9.52,20.67 v10.03,20.67
TX0  (via drill 0.3)
  Top 0.127: 17.46,11.93 17.47,11.93 17.74,11.66 17.74,11.53
  Top 0.152: 17.74,11.57 17.74,11.53 RP1.27 | 17.08,12.23 17.07,12.23 v15.82,12.23
  Top 0.2: 17.08,12.23 17.38,11.93 17.46,11.93
  Bottom 0.2: v15.82,12.23 15.82,12.2 15.15,11.54 8.31,11.54 6.93,12.93 3.81,12.93 3.05,13.69 3.05,14.39 2.67,14.77 2.67,18.26 1.65,19.28 TOP.2
TX1  (via drill 0.3)
  Top 0.2: RP1.6 22.82,7.25 22.48,7.59 v22.48,9.24
  Bottom 0.2: v22.48,9.24 27.05,9.24 29.9,12.09 29.9,17.49 31.69,19.28 BOTTOM.2
USB_DM  (via drill 0.3)
  Top 0.254: R1.2 19.29,1.61 v19.29,0.95
  Bottom 0.2: J1.D- 17.41,4.94 17.55,5.08 21.02,5.08 21.37,4.74 21.37,2.93 21.21,2.77 19.56,2.77 19.29,2.49 v19.29,0.95
USB_DM_1
  Top 0.2: RP1.46 18.54,3.52 19.3,2.76 R1.1
USB_DP  (via drill 0.3)
  Top 0.2: v22.45,0.8 20.89,0.8 20.57,1.11 R2.2
  Bottom 0.2: J1.D+ 16.76,4.92 17.27,5.43 21.17,5.43 21.72,4.88 21.72,2.8 22.45,2.07 v22.45,0.8
USB_DP_1
  Top 0.2: R2.1 20.51,2.7 20.25,2.7 19.68,3.27 19.43,3.27 18.94,3.77 RP1.47
V+  (via drill 0.3)
  Top 0.2: v23.12,0.73 22.8,0.42 22.71,0.42 22.64,0.34 22.2,0.34 22.16,0.39 22.15,0.39
  Top 0.305: D1.C 10.78,1.59 10.78,2.02 11.84,3.08 U2.1 | 18.8,0.49 19.06,0.49 19.17,0.39 22.15,0.39
  Top 0.508: 18.8,0.49 13.49,0.49 12.8,1.18 U2.3 10.97,1.18 D1.C 10.67,1.86 9.75,2.78 C1.1 v9.14,3.53 | TOP.3 2.67,15.33 2.67,10.67 3.27,10.07 5.08,10.07 6.07,9.08 6.07,6.98 6.53,6.53 8.83,6.53 9.14,6.21 v9.14,5.31
  Bottom 0.508: v23.12,0.73 23.24,0.73 25.91,3.4 26.8,3.4 27.93,4.53 27.93,8.96 30.73,11.77 30.73,15.21 BOTTOM.3 | v9.14,3.53 v9.14,5.31
VDD  (via drill 0.3, 0.35)  (3 unrouted)
  Top 0.127: 18.08,11.73 18.07,11.75 18.06,11.75 17.65,12.16 17.65,12.54 16.19,12.54 15.87,12.86 v15.75,12.86
  Top 0.15: 18.08,11.73 | RP1.26 18.04,11.38
  Top 0.152: RP1.26 18.14,11.68 18.08,11.73
  Top 0.2: RP1.44 17.74,3.76 17.34,3.36 | 17.34,3.36 C3.1 | RP1.42 16.5,4.89 15.49,3.88 C2.1 | RP1.48 19.34,4.07 19.74,3.67 | 19.74,3.67 20.12,3.29 21.34,3.29 C7.1 | RP1.43 17.34,3.36 | FLASH.8 10.41,12.25 | 10.41,12.25 10.41,12.53 C14.1 | RP1.1 23.81,5.25 24.13,4.92 24.13,3.03 C8.1 | 24.13,14.56 C9.1 24.27,15.2 24,15.47 20.19,15.47 19.92,15.2 C10.1 | v24.13,11.78 24.04,11.69 24.04,9.03 23.86,8.85 RP1.10 | 10.41,12.25 10.69,11.97 14.26,11.97 v14.3,12 | v14.3,12 14.3,12.7 14.37,12.77 C11.1 | RP1.49 19.74,3.67 | v11.05,19.78 11.11,19.73 IC2.6 | v12.45,19.78 12.45,19.07 IC2.8 13.2,19.03 13.33,18.89 | v11.3,17.62 11.75,17.17 IC2.2 | 13.33,18.89 13.33,17.75 13.47,17.62 IC1.3 | IC1.28 15,19.39 14.86,19.53 13.46,19.53 13.33,19.4 13.33,18.89 | R12.2 R11.2 R14.2 | 14.78,8.86 14.78,11.52 v14.3,12 | 14.78,8.86 v14.78,5.71 | 14.78,8.86 14.79,8.85 RP1.33 | RP1.22 19.74,13.18 | 19.74,13.18 19.74,14.52 C10.1 | v19.68,13.24 19.74,13.18 | C10.1 R13.2
  Top 0.305: C3.1 16.76,2.26 16.64,2.13 15.49,2.13 | C2.1 15.49,2.13 | C7.1 21.85,2.39 22.11,2.13 24.13,2.13 24.38,2.38 C8.1 23.76,3.41 v23.76,3.47 | 15.49,2.13 14.48,2.13 14.23,2.38 U2.5 14.23,3.91 14.78,4.45 v14.78,5.71 | v6.1,21.43 6.1,20.18 C15.1 C16.1 C17.1 C18.1 C19.1 6.08,13.83 6.48,13.43 8.13,13.43 8.64,12.93 C14.1 10.02,14.32 R12.2 | TMP1.1 24.64,24.36 25.15,23.85 25.15,22.2 25.27,22.07 28.45,22.07 28.83,21.69 28.83,15.21 28.62,15.01 I2C.1
  Bottom 0.2: v14.3,12 14.9,12 16.14,13.24 v19.68,13.24 19.68,12.61 20.51,11.78 v24.13,11.78
  Bottom 0.305: 14.9,5.83 21.31,5.83 22.1,5.04 22.1,4.67 22.1,3.26 22.46,2.89 23.18,2.89 v23.76,3.47 | v6.1,21.43 11.05,21.43 | 11.05,21.43 12.19,21.43 12.7,21.94 12.7,24.34 TMP0.1 | v11.05,19.78 11.05,21.43 | v11.05,19.78 v12.45,19.78 | v11.05,19.78 11.3,19.53 v11.3,17.62 | v24.13,11.78 26.92,14.58 I2C.1
XIN1  (via drill 0.3)
  Top 0.2: v20.48,10.15 20.54,10.21 RP1.20 | C12.1 26.43,6.63 X1.3 v26.54,6.7
  Bottom 0.2: v26.54,6.7 24.34,6.7 20.89,10.15 v20.48,10.15
XOUT1
  Top 0.2: R5.2 25.28,12.54 25.28,12.83 | 25.28,12.83 25.28,12.93 | RP1.21 20.14,12.47 21.02,13.35 24.77,13.35 25.28,12.83

### Text on the board
tStop: 2022 WASA Rocket
bStop: TERES Sensor Module